# EAGLE design pressuresense (EAGLE 6.4)
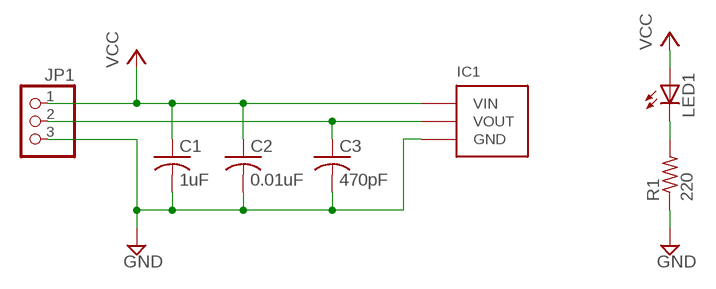
[diagram p0: schematic, sheet 1]

## Parts
C1  1uF  C-USC0805K  [C0805K]
C2  0.01uF  C-USC0805K  [C0805K]
C3  470pF  C-USC0805K  [C0805K]
IC1  MPXA4250AC6U  [MPXA4250AC6U]
JP1  PINHD-1X3  [1X03]
LED1  LEDCHIP-LED0805  [CHIP-LED0805]
R1  220  R-US_R0805  [R0805]

## Nets
GND: C1.2 C2.2 C3.2 IC1.P$3(GND) JP1.3 R1.1
N$1: LED1.C R1.2
VCC: C1.1 C2.1 IC1.P$2(VIN) JP1.1 LED1.A
VOUT: C3.1 IC1.P$4(VOUT) JP1.2

## Library data of the parts
C1-C3 = resistor:C-US: CAPACITOR, American symbol
IC1 = custom:MPXA4250AC6U
JP1 = pinhead:PINHD-1X3: PIN HEADER
LED1 = led:LED: LED OSRAM: - CHIPLED LG R971, LG N971, LY N971, LG Q971, LY Q971, LO R971, LY R971 LH N974, LH R974 LS Q976, LO Q976, LY Q976 LO Q996 - Hyper CHIPLED LW Q18S LB Q993, LB Q99A, LB R99A - SideLED LS A670, LO A670, LY A670, LG A670, LP A670 LB A673, LV A673, LT A673, LW A673 LH A674 LY A675 LS A676, LA A676, LO A676, LY A676, LW A676 LS A679, LY A679, LG A679 - Hyper Micro SIDELED® LS Y876, LA Y876, LO Y876, LY Y876 LT Y87S - SmartLED LW L88C, LW L88S LB L89C, LB L89S, LG L890 LS L89K, LO L89K, LY L89K LS L896, LA L896, LO L896, LY L896 - TOPLED LS T670, LO T670, LY T670, LG T670, LP T670 LSG T670, LSP T670, LSY T670, LOP T670, LYG T670 LG T671, LOG T671, LSG T671 LB T673, LV T673, LT T673, LW T673 LH T674 LS T676, LA T676, LO T676, LY T676, LB T676, LH T676, LSB T676, LW T676 LB T67C, LV T67C, LT T67C, LS T67K, LO T67K, LY T67K, LW E67C LS E67B, LA E67B, LO E67B, LY E67B, LB E67C, LV E67C, LT E67C LW T67C LS T679, LY T679, LG T679 LS T770, LO T770, LY T770, LG T770, LP T770 LB T773, LV T773, LT T773, LW T773 LH T774 LS E675, LA E675, LY E675, LS T675 LS T776, LA T776, LO T776, LY T776, LB T776 LHGB T686 LT T68C, LB T68C - Hyper Mini TOPLED® LB M676 - Mini TOPLED Santana® LG M470 LS M47K, LO M47K, LY M47K Source: http://www.osram.convergy.de LUXEON: - LUMILED® LXK2-PW12-R00, LXK2-PW12-S00, LXK2-PW14-U00, LXK2-PW14-V00 LXK2-PM12-R00, LXK2-PM12-S00, LXK2-PM14-U00 LXK2-PE12-Q00, LXK2-PE12-R00, LXK2-PE12-S00, LXK2-PE14-T00, LXK2-PE14-U00 LXK2-PB12-K00, LXK2-PB12-L00, LXK2-PB12-M00, LXK2-PB14-N00, LXK2-PB14-P00, LXK2-PB14-Q00 LXK2-PR12-L00, LXK2-PR12-M00, LXK2-PR14-Q00, LXK2-PR14-R00 LXK2-PD12-Q00, LXK2-PD12-R00, LXK2-PD12-S00 LXK2-PH12-R00, LXK2-PH12-S00 LXK2-PL12-P00, LXK2-PL12-Q00, LXK2-PL12-R00 Source: www.luxeon.com KINGBRIGHT: KA-3528ASYC Source: www.kingbright.com
R1 = resistor:R-US_: RESISTOR, American symbol

## Board
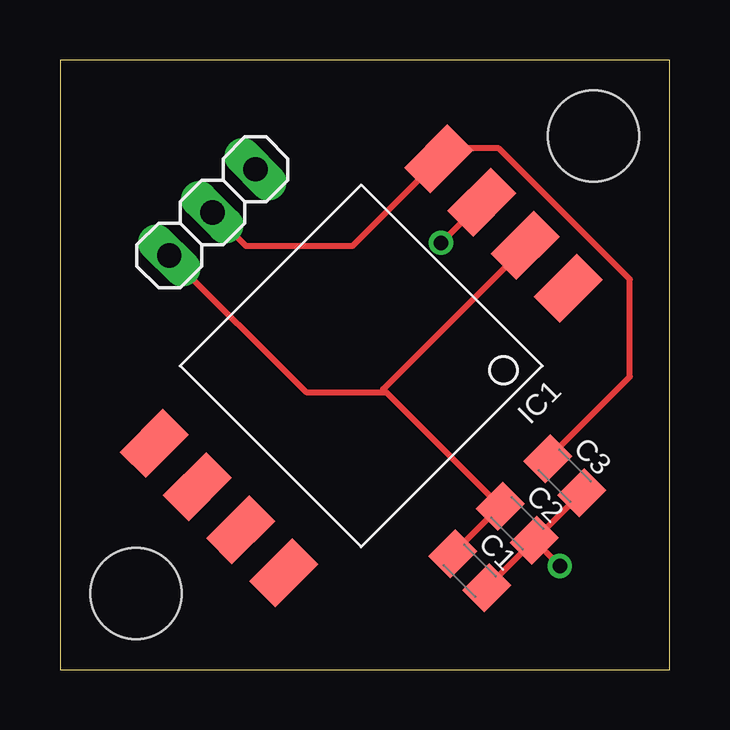
[diagram p1: board, top side]
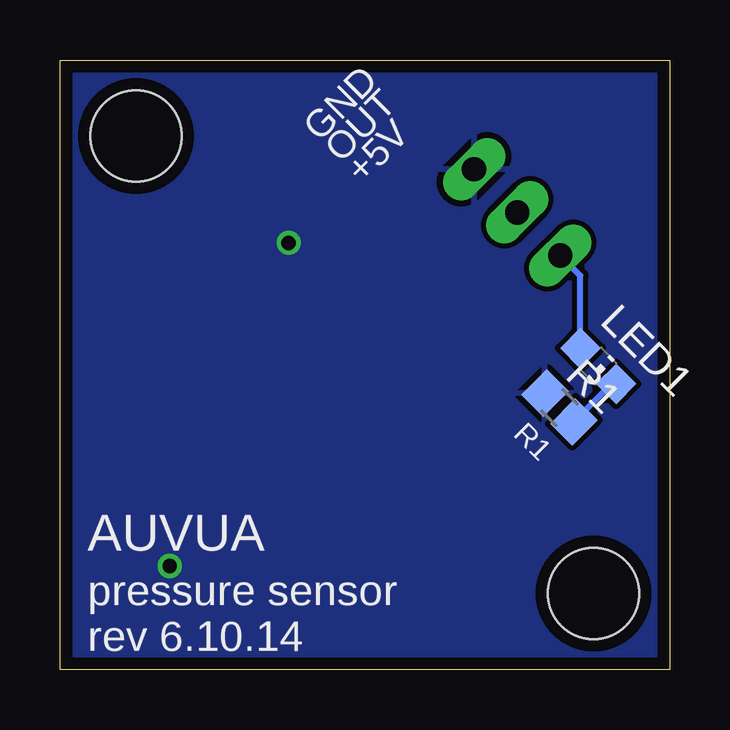
[diagram p2: board, bottom side, seen from below]

Size 25.4 x 25.4 mm. Coordinates in mm from the lower left corner, seen from the top.
Outline: 0,0 25.4,0 25.4,25.4 0,25.4 0,0
Copper layers (1*16): Top 0.035mm / dielectric 1.5mm / Bottom 0.035mm
Design rules "default *": minimum track width 10mil, minimum drill 24mil, track to track 8mil, track to pad 8mil, pad to pad 8mil, via to via 8mil, smd to smd 8mil, copper to edge 20mil, drill to drill 8mil, minimum pad ring 10mil, minimum via ring 8mil, stop-mask expansion 4mil, vias tented up to drill 0mil, thermal gap 10mil
Holes 3.8 mm at 3.17,3.17 22.23,22.23

### Footprints (pad centres in the part's own frame; a part is rotated, then mirrored left to right if it is on the bottom)
C0805K = smd 1.3 x 1.6: 1 -1,0; 2 1,0
MPXA4250AC6U = smd 2.54 x 1.524: P$1 8.382,-3.81; P$2 8.382,-1.27; P$3 8.382,1.27; P$4 8.382,3.81; P$5 -8.382,3.81; P$6 -8.382,1.27; P$7 -8.382,-1.27; P$8 -8.382,-3.81
1X03 = drill 1.016 long: 1 -2.54,0; 2 0,0; 3 2.54,0
CHIP-LED0805 = smd 1.2 x 1.2: A 0,-1.05; C 0,1.05
R0805 = smd 1.3 x 1.5: 1 -0.85,0; 2 0.85,0

### Placement (x,y rotation side)
C1  17.07,4.12 315 top
C2  19.05,6.1 315 top
C3  21.03,8.08 315 top
IC1  12.55,12.66 45 top
JP1  6.35,19.05 45 top
LED1  2.97,12.65 225 bottom
R1  4.59,10.92 315 bottom

### Tracks (layer width: path | path; a pad name or v marks a point on that pad's centre or on a via)
GND  (via drill 0.6)
  Top 0.254: C1.2 C2.2 | C2.2 21.61,7.24 C3.2 | C2.2 v20.83,4.32 | v20.83,4.32 | v15.88,17.78 IC1.P$3
  pour Bottom: -0.76,26.16 26.67,26.16 26.67,-0.51 -0.76,-0.51
N$1
  Bottom 0.254: LED1.C 2.41,11.9 R1.2
VCC
  Top 0.254: C1.1 C2.1 13.59,11.56 | IC1.P$2 19.38,17.6 13.46,11.68 | 13.59,11.56 13.46,11.68 | 13.46,11.68 | JP1.1 10.25,11.56 13.59,11.56
  Bottom 0.254: LED1.A 3.72,16.42 JP1.1
VOUT
  Top 0.254: JP1.2 7.75,17.65 12.19,17.65 15.78,21.25 IC1.P$4 16.58,21.28 17.02,21.72 18.29,21.72 23.75,16.26 23.75,12.21 C3.1

### Text on the board
bPlace: GND | +5V | OUT | R1 | AUVUA | pressure sensor | rev 6.10.14